# EAGLE design ROm-el HN61256 Adapter (EAGLE 7.7.0)
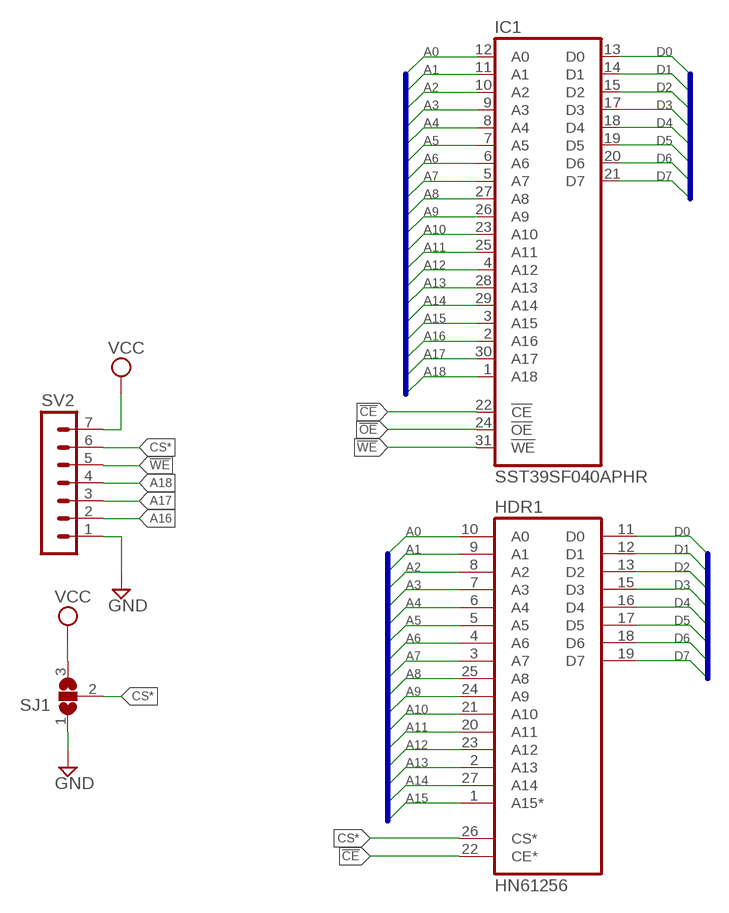
[diagram p0: schematic, sheet 1]

## Parts
HDR1  HN61256  [DIL28-6]
IC1  SST39SF040APHR  [DIL32-RP]
SJ1  SJ2W  [SJ_2]
SV2  MA07-1  [MA07-1]

## Nets
!CE: HDR1.22(CE*) IC1.22(!CE)
!OE: IC1.24(!OE)
!WE: IC1.31(!WE) SV2.5
A0: HDR1.10(A0) IC1.12(A0)
A1: HDR1.9(A1) IC1.11(A1)
A2: HDR1.8(A2) IC1.10(A2)
A3: HDR1.7(A3) IC1.9(A3)
A4: HDR1.6(A4) IC1.8(A4)
A5: HDR1.5(A5) IC1.7(A5)
A6: HDR1.4(A6) IC1.6(A6)
A7: HDR1.3(A7) IC1.5(A7)
A8: HDR1.25(A8) IC1.27(A8)
A9: HDR1.24(A9) IC1.26(A9)
A10: HDR1.21(A10) IC1.23(A10)
A11: HDR1.20(A11) IC1.25(A11)
A12: HDR1.23(A12) IC1.4(A12)
A13: HDR1.2(A13) IC1.28(A13)
A14: HDR1.27(A14) IC1.29(A14)
A15: HDR1.1(A15*) IC1.3(A15)
A16: IC1.2(A16) SV2.2
A17: IC1.30(A17) SV2.3
A18: IC1.1(A18) SV2.4
CS*: HDR1.26(CS*) SJ1.2 SV2.6
D0: HDR1.11(D0) IC1.13(D0)
D1: HDR1.12(D1) IC1.14(D1)
D2: HDR1.13(D2) IC1.15(D2)
D3: HDR1.15(D3) IC1.17(D3)
D4: HDR1.16(D4) IC1.18(D4)
D5: HDR1.17(D5) IC1.19(D5)
D6: HDR1.18(D6) IC1.20(D6)
D7: HDR1.19(D7) IC1.21(D7)
GND: SJ1.1 SV2.1
VCC: SJ1.3 SV2.7

## Buses
A[0..18]
D[0..7]

## Power pins joined to a net without a drawn wire
GND: HDR1.14(GND) IC1.16(GND)
VCC: HDR1.28(VCC) IC1.32(VCC)

## Library data of the parts
HDR1 = memory-hitachi-jlb:HN61256
IC1 = memory-sst:SST39SF040A: 4 Mbit x8 Multi-Purpose Flash Source: http://www.sst.com/dotAsset/40782.pdf
SJ1 = jumper-jlb:SJ2W: SMD solder JUMPER
SV2 = con-lstb-rp:MA07-1: PIN HEADER; OC_FARNELL: unknown; OC_NEWARK: unknown

## Board
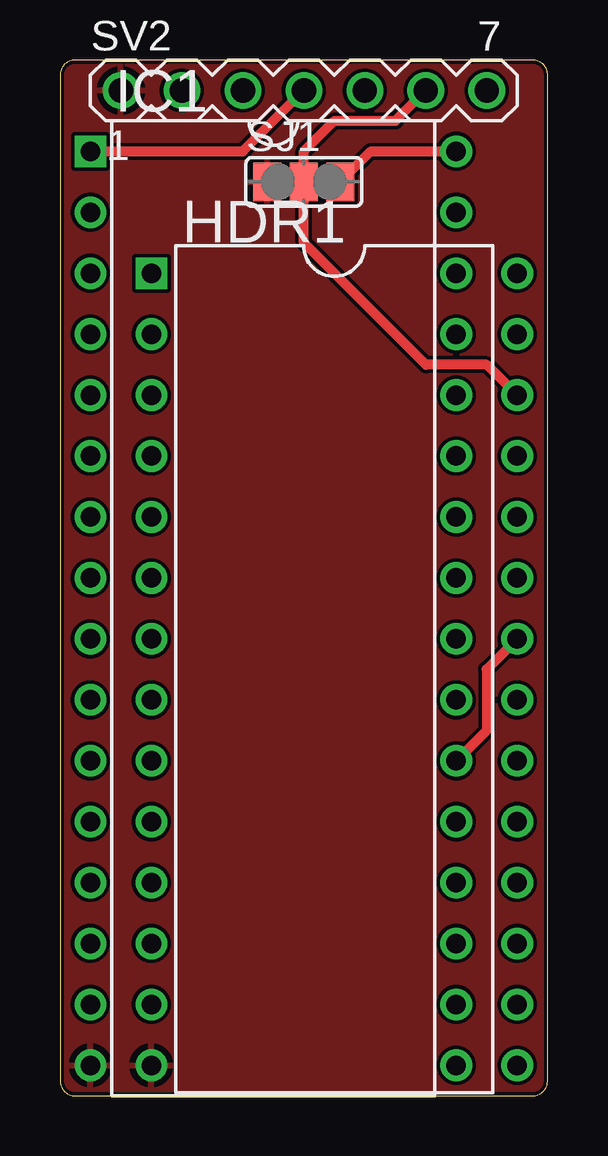
[diagram p1: board, top side]
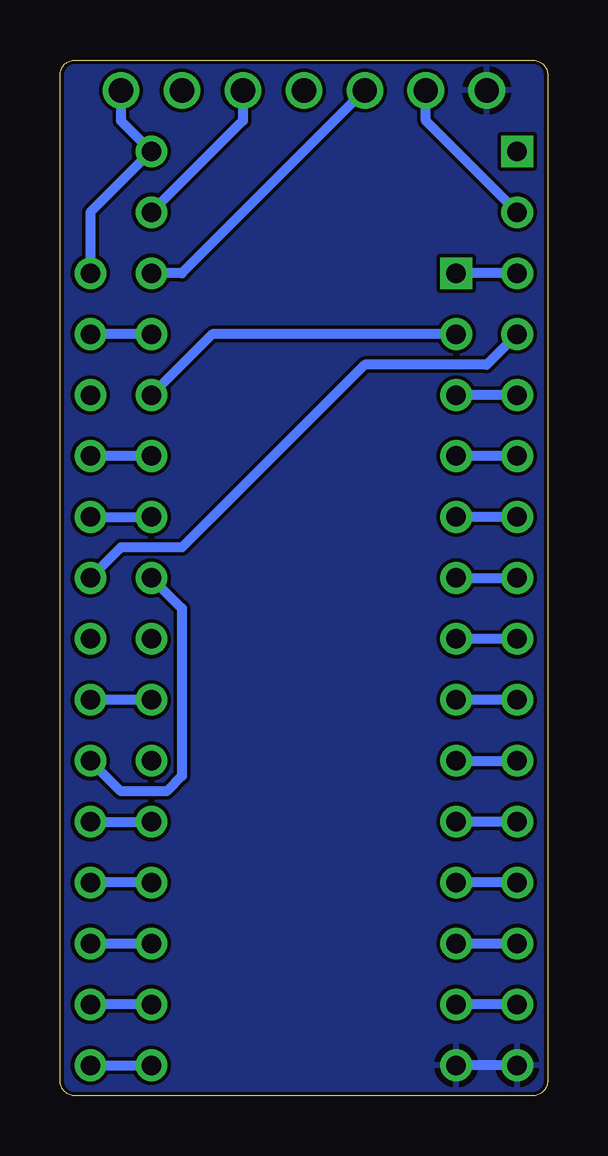
[diagram p2: board, bottom side, seen from below]

Size 20.32 x 43.18 mm. Coordinates in mm from the lower left corner, seen from the top.
Outline: 0,42.55 0,0.64 arc90 0.63,0 19.69,0 arc90 20.32,0.64 20.32,42.55 arc90 19.69,43.18 0.63,43.18 arc90 0,42.55
Copper layers (1*16): Top 0.035mm / dielectric 1.5mm / Bottom 0.035mm
Design rules "hackvana": minimum track width 6mil, minimum drill 0.3mm, track to track 6mil, track to pad 6mil, pad to pad 6mil, via to via 6mil, smd to smd 0mil, copper to edge 6mil, drill to drill 6mil, minimum pad ring 10mil, minimum via ring 6mil, stop-mask expansion 2mil, vias tented up to drill 100mil, thermal gap 10mil

### Footprints (pad centres in the part's own frame; a part is rotated, then mirrored left to right if it is on the bottom)
DIL28-6 = drill 0.813 square: 1 -16.51,-7.62 | drill 0.813: 2 -13.97,-7.62; 3 -11.43,-7.62; 4 -8.89,-7.62; 5 -6.35,-7.62; 6 -3.81,-7.62; 7 -1.27,-7.62; 8 1.27,-7.62; 9 3.81,-7.62; 10 6.35,-7.62; 11 8.89,-7.62; 12 11.43,-7.62; 13 13.97,-7.62; 14 16.51,-7.62; 15 16.51,7.62; 16 13.97,7.62; 17 11.43,7.62; 18 8.89,7.62; 19 6.35,7.62; 20 3.81,7.62; 21 1.27,7.62; 22 -1.27,7.62; 23 -3.81,7.62; 24 -6.35,7.62; 25 -8.89,7.62; 26 -11.43,7.62; 27 -13.97,7.62; 28 -16.51,7.62
DIL32-RP = drill 0.813 square: 1 -19.05,-7.62 | drill 0.813: 2 -16.51,-7.62; 3 -13.97,-7.62; 4 -11.43,-7.62; 5 -8.89,-7.62; 6 -6.35,-7.62; 7 -3.81,-7.62; 8 -1.27,-7.62; 9 1.27,-7.62; 10 3.81,-7.62; 11 6.35,-7.62; 12 8.89,-7.62; 13 11.43,-7.62; 14 13.97,-7.62; 15 16.51,-7.62; 16 19.05,-7.62; 17 19.05,7.62; 18 16.51,7.62; 19 13.97,7.62; 20 11.43,7.62; 21 8.89,7.62; 22 6.35,7.62; 23 3.81,7.62; 24 1.27,7.62; 25 -1.27,7.62; 26 -3.81,7.62; 27 -6.35,7.62; 28 -8.89,7.62; 29 -11.43,7.62; 30 -13.97,7.62; 31 -16.51,7.62; 32 -19.05,7.62
SJ_2 = smd 1.168 x 1.6: 1 -1.524,0; 2 0,0; 3 1.524,0
MA07-1 = drill 1.016: 1 -7.62,0; 2 -5.08,0; 3 -2.54,0; 4 0,0; 5 2.54,0; 6 5.08,0; 7 7.62,0

### Placement (x,y rotation side)
HDR1  11.43,17.78 270 top
IC1  8.89,20.32 270 top
SJ1  10.16,38.1 0 top
SV2  10.16,41.91 0 top

### Tracks (layer width: path | path; a pad name or v marks a point on that pad's centre or on a via)
!CE
  Top 0.406: HDR1.22 17.78,17.78 17.78,15.24 IC1.22
!WE
  Bottom 0.406: SV2.5 12.7,40.64 IC1.31
A0
  Bottom 0.406: IC1.12 HDR1.10
A1
  Bottom 0.406: HDR1.9 IC1.11
A2
  Bottom 0.406: IC1.10 HDR1.8
A3
  Bottom 0.406: IC1.9 HDR1.7
A4
  Bottom 0.406: HDR1.6 IC1.8
A5
  Bottom 0.406: IC1.7 HDR1.5
A6
  Bottom 0.406: IC1.6 HDR1.4
A7
  Bottom 0.406: IC1.5 HDR1.3
A8
  Bottom 0.406: IC1.27 HDR1.25
A9
  Bottom 0.406: HDR1.24 IC1.26
A10
  Bottom 0.406: IC1.23 HDR1.21
A11
  Bottom 0.406: IC1.25 15.24,20.32 15.24,13.34 15.88,12.7 17.78,12.7 HDR1.20
A12
  Bottom 0.406: IC1.4 2.54,30.48 7.62,30.48 15.24,22.86 17.78,22.86 HDR1.23
A13
  Bottom 0.406: HDR1.2 13.97,31.75 IC1.28
A14
  Bottom 0.406: IC1.29 HDR1.27
A15
  Bottom 0.406: IC1.3 HDR1.1
A16
  Bottom 0.406: IC1.2 5.08,40.64 SV2.2
A17
  Bottom 0.406: SV2.3 15.24,34.29 IC1.30
A18
  Top 0.406: IC1.1 7.62,39.37 SV2.4
CS*
  Top 0.406: SV2.6 13.97,40.64 11.43,40.64 10.16,39.37 SJ1.2 10.16,35.56 15.24,30.48 17.78,30.48 HDR1.26
D0
  Bottom 0.406: IC1.13 HDR1.11
D1
  Bottom 0.406: HDR1.12 IC1.14
D2
  Bottom 0.406: IC1.15 HDR1.13
D3
  Bottom 0.406: HDR1.15 IC1.17
D4
  Bottom 0.406: IC1.18 HDR1.16
D5
  Bottom 0.406: HDR1.17 IC1.19
D6
  Bottom 0.406: IC1.20 HDR1.18
D7
  Bottom 0.406: HDR1.19 IC1.21
GND
  Bottom 0.406: IC1.16 HDR1.14
  pour Bottom: 20.32,42.55 20.32,0.64 arc-90 19.69,0 0.63,0 arc-90 0,0.64 0,42.55 arc-90 0.63,43.18 19.69,43.18 arc-90
  pour Top: 20.32,42.55 20.32,0.64 arc-90 19.69,0 0.63,0 arc-90 0,0.64 0,42.55 arc-90 0.63,43.18 19.69,43.18 arc-90
VCC
  Top 0.406: SJ1.3 12.95,39.37 IC1.32
  Bottom 0.406: HDR1.28 19.05,36.83 IC1.32 17.78,40.64 SV2.7